# Altium schematic sheet SingleASIC.SchDoc
size A
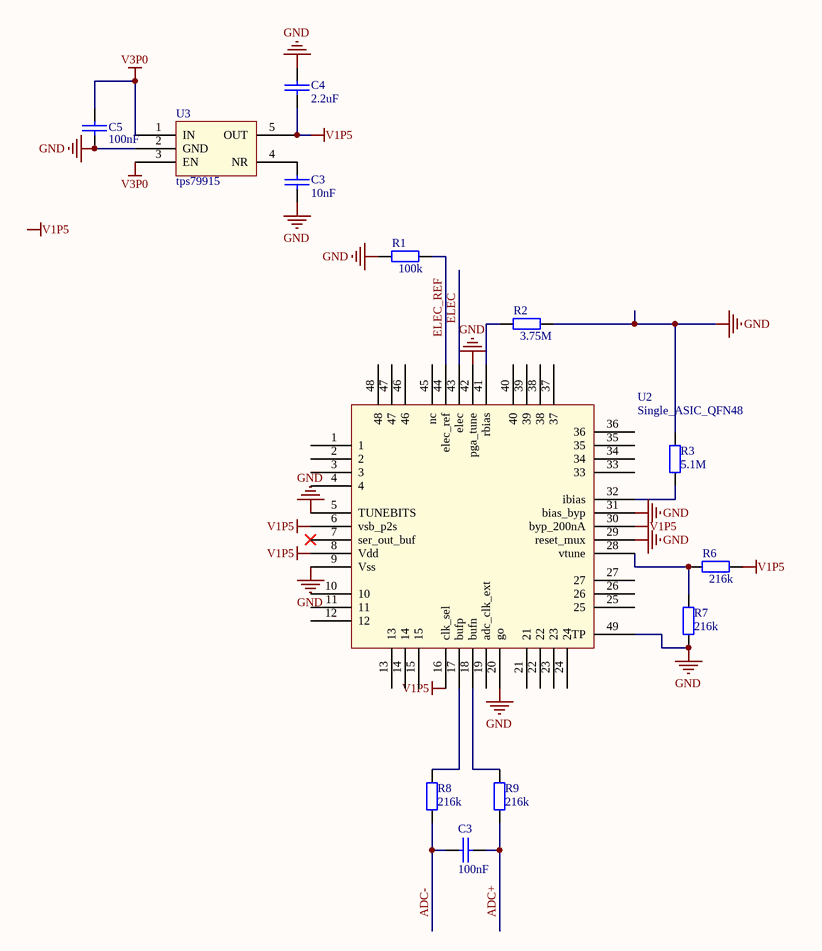
[diagram p0: SingleASIC.SchDoc]

## Parts
(Parts that share a designator on the sheet are numbered #1, #2 ... from top to bottom, then left to right.)
C3#1  value 10nF  [0402s]  (hidden comment: NP0 50V)
C3#2  value 100nF  [0402s]  (hidden comment: NP0 50V)
C4  value 2.2uF  [0402s]  (hidden comment: NP0 50V)
C5  value 100nF  [0402s]  (hidden comment: NP0 50V)
R1  value 100k  [0402s]  (hidden comment: Res2)
R2  value 3.75M  [0402s]  (hidden comment: Res2)
R3  value 5.1M  [0402s]  (hidden comment: Res2)
R6  value 216k  [0402s]  (hidden comment: Res2)
R7  value 216k  [0402s]  (hidden comment: Res2)
R8  value 216k  [0402s]  (hidden comment: Res2)
R9  value 216k  [0402s]  (hidden comment: Res2)
U2  Single_ASIC_QFN48  [Single_ASIC]
U3  tps79915  [SOT23-5AN]

## Nets
GND: C3#1.1 C4.2 C5.1 R1.1 R2.2 R3.2 R7.1 U2.5(TUNEBITS) U2.9(Vss) U2.20(go) U2.29(reset_mux) U2.31(bias_byp) U2.42(pga_tune) U2.49(TP) U3.2(GND)
V1P5: C4.1 R6.2 U2.6(vsb_p2s) U2.8(Vdd) U2.16(clk_sel) U2.30(byp_200nA) U3.5(OUT)
V3P0: C5.2 U3.1(IN) U3.3(EN)
ADC+: C3#2.1 R9.1
ADC-: C3#2.2 R8.1
ELEC: U2.43(elec)
ELEC_REF: R1.2 U2.44(elec_ref)
NetC3#1_2: C3#1.2 U3.4(NR)
NetR2_1: R2.1 U2.41(rbias)
NetR3_1: R3.1 U2.32(ibias)
NetR6_1: R6.1 R7.2 U2.28(vtune)
NetR8_2: R8.2 U2.17(bufp)
NetR9_2: R9.2 U2.18(bufn)

Not connected (* = marked no-connect by the designer): U2 1 2 3 4 7(ser_out_buf)* 10 11 12 13 14 15 19(adc_clk_ext) 21 22 23 24 25 26 27 33 34 35 36 37 38 39 40 45(nc) 46 47 48

## Notes on the sheet
- Labels drawn without touching a wire or pin: V1P5

## Library data of the parts
C3#1 C3#2 C4 C5 = Cap: Capacitor; Part Field 1: 0402
R1-R3 R6-R9 = Res2: Resistor; Published: 8-Jun-2000; LatestRevisionDate: 17-Jul-2002; LatestRevisionNote: Re-released for DXP Platform.; PackageReference: AXIAL-0.4; Publisher: Altium Limited; PackageDescription: Axial Device, Thru-Hole; 2 Leads; 0.4 in Pin Spacing